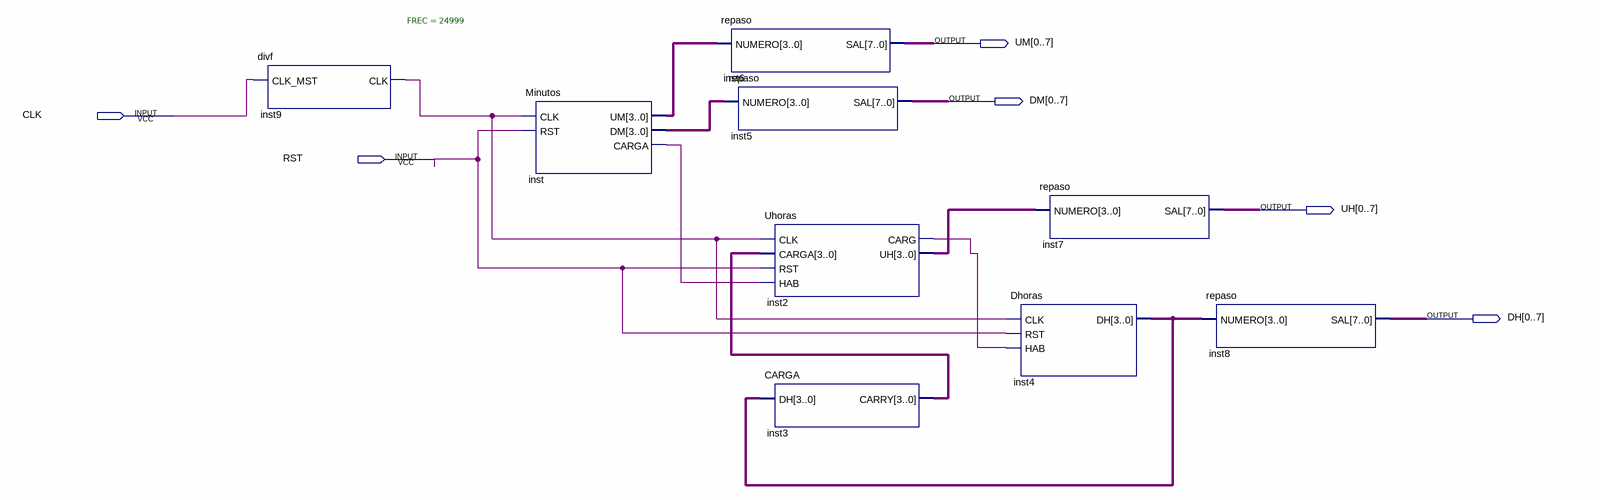
[diagram p0: schematic sheet]
// Quartus schematic Practica3.bdf as structural Verilog: 9 symbols, 6 pins
module Practica3 (
  input  CLK,
  input  RST,
  output [0:7] UM,
  output [0:7] DM,
  output [0:7] UH,
  output [0:7] DH
);

  wire inst2_carg, inst9_clk, inst_carga;
  wire [3:0] inst2_uh, inst3_carry, inst4_dh, inst_dm, inst_um;

  divf #(.FREC(24999)) inst9 (.CLK_MST(CLK), .CLK(inst9_clk));
  Minutos inst (.CLK(inst9_clk), .RST(RST), .UM(inst_um), .DM(inst_dm), .CARGA(inst_carga));
  repaso inst6 (.NUMERO(inst_um), .SAL(UM));
  repaso inst5 (.NUMERO(inst_dm), .SAL(DM));
  Uhoras inst2 (.CLK(inst9_clk), .CARGA(inst3_carry), .RST(RST), .HAB(inst_carga), .CARG(inst2_carg), .UH(inst2_uh));
  CARGA inst3 (.DH(inst4_dh), .CARRY(inst3_carry));
  repaso inst7 (.NUMERO(inst2_uh), .SAL(UH));
  Dhoras inst4 (.CLK(inst9_clk), .RST(RST), .HAB(inst2_carg), .DH(inst4_dh));
  repaso inst8 (.NUMERO(inst4_dh), .SAL(DH));
endmodule
